# Altium schematic sheet Schem_Example.SchDoc
size A4; Organization: Altium Limited; Address1: L3, 12a Rodborough Rd; Address2: Frenchs Forest; Address3: NSW; Address4: Australia 2086
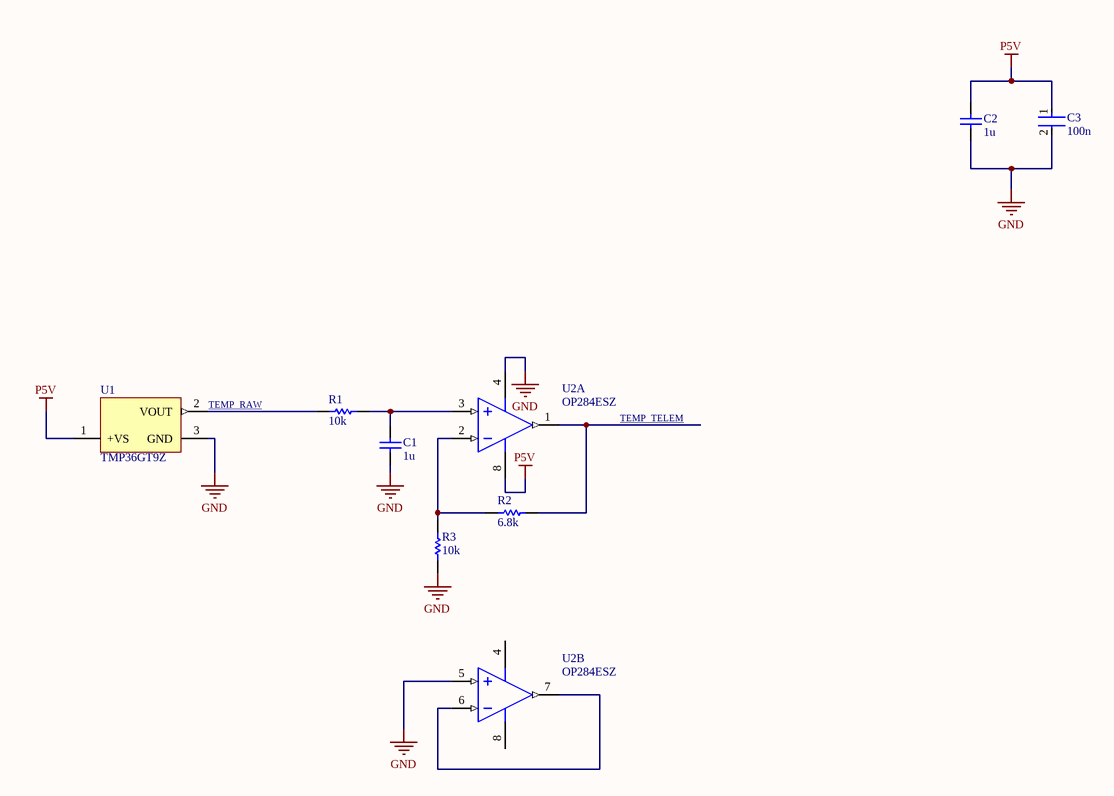
[diagram p0: Schem_Example.SchDoc]

## Parts
C1  1u  [CAPC1608X90X35NL15T15]
C2  1u  [CAPC1608X90X35NL15T15]
C3  100n  [FP-C0402-BB-MFG]
R1  10k  [RESC1609X50X30NL8T20]
R2  6.8k  [RESC1609X50X30LL10T20]
R3  10k  [RESC1609X50X30NL8T20]
U1  TMP36GT9Z  [ADI-T-3]
U2  OP284ESZ  [ADI-R-8_L]  (parts A,B of 2)

## Nets
GND: C1.1 C2.1 C3.2 R3.1 U1.3(GND) U2.4(-V) U2.5(+IN_B)
P5V: C2.2 C3.1 U1.1(+VS) U2.8(+V)
NetC1_2: C1.2 R1.1 U2.3(+IN_A)
NetR1_2: R1.2 U1.2(VOUT)
NetR2_1: R2.1 R3.2 U2.2(-IN_A)
NetR2_2: R2.2 U2.1(OUT_A)
NetU2_6: U2.6(-IN_B) U2.7(OUT_B)

## Notes on the sheet
- (near U1) TEMP_RAW
- TEMP_TELEM
- Title
- Size:
- Date:
- A4
- Number:
- Time:
- Revision:
- Sheet
- of
- File:

## Library data of the parts
C1 C2 = CMP-2006-04474-1: Part Number: 06036D105KAT2A; Manufacturer: AVX Interconnect / Elco
C3 = CMP-03020-023811-1: CAP CER 0.1UF 10V X5R 0402; Manufacturer: Kemet; Manufacturer Part Number: C0402C104K8PACTU; Material: Ceramic; Capacitance: 0.10 μF; Temperature Coefficient: 15%; Description: C0402 0.10 μF X5R 10.00% 10 V; Tolerance: 0.1; Value: 0.10 μF; Package: C0402-BB; Temperature: -55°C to +125°C; ComponentLink2Description: Datasheet; Temperature Characteristic: X5R; Device Class L1: Passive Components; Height: 0.55mm; Lead Free: Yes; ComponentLink2URL: https://content.kemet.com/datasheets/KEM_C1002_X7R_SMD.pdf; Device Class L2: Capacitors; Temperature Range Low: -55°C; Temperature Range High: +125°C; RoHS: TRUE; Octopart: https://octopart.com/c0402c104k8pactu-kemet-140039; Automotive: No; Mouser Description: Capacitor 100 nF 10 VDC 0402; Category: Cap; Voltage Rating: 10 V; Digikey Description: CAP CER 0.1UF 10V X5R 0402; Ipc Land Pattern Name: CAPC10050X50; Device Class L3: Ceramic Capacitors
R1 R3 = CMP-1666-00005-4: Chip Resistor, 10 KOhm, +/- 1%, 100 mW, -55 to 155 degC, 0603 (1608 Metric), RoHS, Tape and Reel; Manufacturer: Vishay Semiconductor; Voltage Rating: 75 V; Max Operating Temperature: 155 degC; PackageDescription: 2-Pin Surface Mount Device, Body 1.575 x 0.85 mm; ComponentLink1Description: Manufacturer URL; RoHSCompliant: true; PackageReference: 0603; REACH SVHC: Unknown; Length: 1.55 mm; DatasheetVersion: 06/2012; Packaging: Tape and Reel; Min Operating Temperature: -55 degC; Mounting Technology: Surface Mount; ComponentLink2URL: https://datasheet.ciiva.com/11809/0900766b80d98afc-11809037.pdf; Height: 0.45 mm; ComponentLink2Description: Datasheet; Package Quantity: 5000; ComponentLink1URL: http://www.vishay.com/
R2 = CMP-2000-03550-1: Part Number: CRCW06036K80FKEA; Manufacturer: Vishay Dale
U1 = CMP-0887-00067-1: Low Voltage Temperature Sensor, 2.7 to 5.5 V Supply, Industrial, 3-pin TO92 (T-3), Tray; Manufacturer: Analog Devices; ComponentLink2Description: Datasheet; PackageReference: T-3; Packing: Tray; ComponentLink2URL: http://www.analog.com/static/imported-files/data_sheets/TMP35_36_37.pdf; ComponentLink4Description: Product URL; ComponentLink3Description: Package Specification; Code_JEDEC: TO-226-AA; PartNumber: TMP36GT9Z; PackageDescription: 3-Pin Plastic Header-Style Package, 1.27 mm Pitch; PackageVersion: 042208-A, 04/2008; ComponentLink3URL: http://www.analog.com/static/imported-files/packages/PKG_PDF/TO-92(T)/T_3.pdf; ComponentLink1Description: Manufacturer URL; Supply Voltage Range: 2.7 to 5.5 V; Mounting Technology: Through Hole; DatasheetVersion: Rev. F; ComponentLink4URL: http://www.analog.com/en/mems-sensors/digital-temperature-sensors/tmp36/products/product.html; ComponentLink1URL: http://www.analog.com/en/index.html
U2 = CMP-0384-00701-1: Double Channel Single-Supply Operation Operational Amplifier, 4.25 MHz BW, 4 V/us SR, Industrial, 8-pin SOIC (R-8), Tube; Generic Part Number: OP284; Manufacturer: Analog Devices; Slew Rate: 4V/us; Amplifiers Per Package: 2; Input Offset Voltage: 175uV; V Span Max: 36V; Iq/Amp: 2mA; V Span Min: 3V; Input Bias Current: 80nA; ComponentLink1URL: http://www.analog.com/en/index.html; PackageReference: R-8; Code_JEDEC: MS-012-AA; Small Signal Bandwidth: 4.25MHz; DatasheetVersion: Rev. J; PackageDescription: 8-Pin Standard Small Outline Package, Body 3.9 x 4.9 mm, Pitch 1.27 mm; ComponentLink3Description: Package Specification; PackageVersion: 060506-A; ComponentLink2Description: Datasheet; ComponentLink3URL: http://www.analog.com/static/imported-files/packages/PKG_PDF/SOIC_Narrow%20(R)/R_8.pdf; Mounting Technology: Surface Mount; ComponentLink2URL: http://www.analog.com/static/imported-files/data_sheets/OP184_284_484.pdf; PartNumber: OP284ESZ; ComponentLink1Description: Manufacturer URL